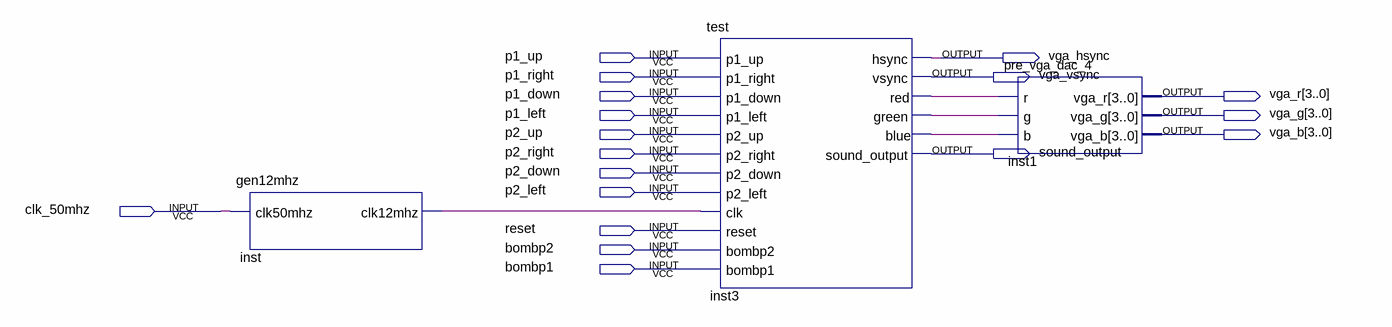
[diagram p0: schematic sheet]
// Quartus schematic top_de1.bdf as structural Verilog: 3 symbols, 18 pins
module top_de1 (
  input  p1_up,
  input  p1_right,
  input  p1_down,
  input  p1_left,
  input  p2_up,
  input  p2_right,
  input  p2_down,
  input  p2_left,
  input  clk_50mhz,
  input  reset,
  input  bombp2,
  input  bombp1,
  output vga_hsync,
  output vga_vsync,
  output [3:0] vga_r,
  output [3:0] vga_g,
  output [3:0] vga_b,
  output sound_output
);

  wire inst3_blue, inst3_green, inst3_red, inst_clk12mhz;

  gen12mhz inst (.clk50mhz(clk_50mhz), .clk12mhz(inst_clk12mhz));
  test inst3 (
    .p1_up(p1_up), .p1_right(p1_right), .p1_down(p1_down), .p1_left(p1_left), .p2_up(p2_up),
    .p2_right(p2_right), .p2_down(p2_down), .p2_left(p2_left), .clk(inst_clk12mhz), .reset(reset),
    .bombp2(bombp2), .bombp1(bombp1), .hsync(vga_hsync), .vsync(vga_vsync), .red(inst3_red),
    .green(inst3_green), .blue(inst3_blue), .sound_output(sound_output));
  pre_vga_dac_4 inst1 (.r(inst3_red), .g(inst3_green), .b(inst3_blue), .vga_r(vga_r), .vga_g(vga_g), .vga_b(vga_b));
endmodule
